# EAGLE design USB_Dongle_Parem (EAGLE 7.2.0)
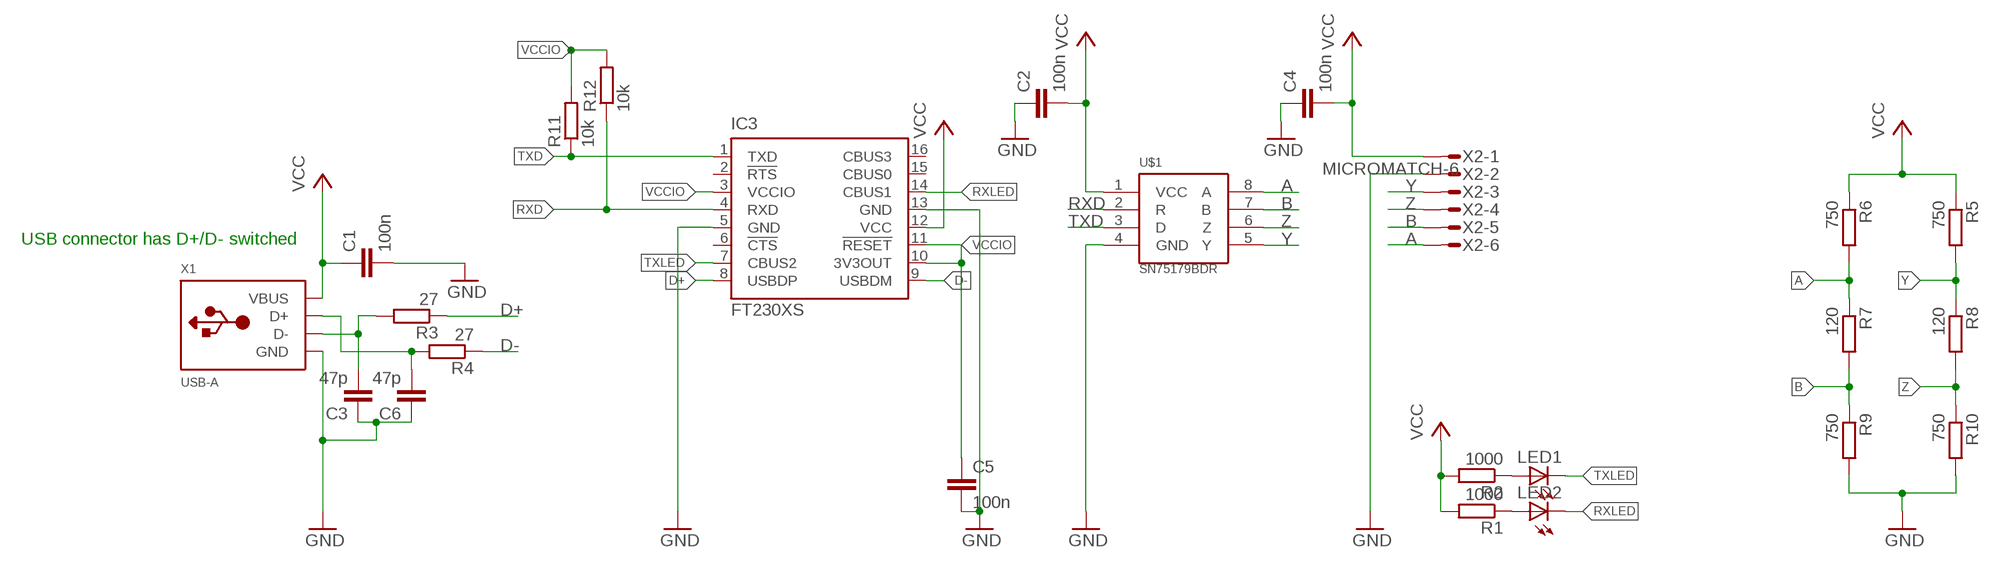
[diagram p0: schematic, sheet 1]

## Parts
C1  100n  CC0603  [C0603]
C2  100n  CC0603  [C0603]
C3  47p  CC0603  [C0603]
C4  100n  CC0603  [C0603]
C5  100n  CC0603  [C0603]
C6  47p  CC0603  [C0603]
IC3  FT230XS  [SSOP16]
LED1  LED_ESML0603  [LED_SML0603]
LED2  LED_ESML0603  [LED_SML0603]
R1  1000  R-EU_R0603  [R0603]
R2  1000  R-EU_R0603  [R0603]
R3  27  R-EU_R0603  [R0603]
R4  27  R-EU_R0603  [R0603]
R5  750  R-EU_R0603  [R0603]
R6  750  R-EU_R0603  [R0603]
R7  120  R-EU_R0603  [R0603]
R8  120  R-EU_R0603  [R0603]
R9  750  R-EU_R0603  [R0603]
R10  750  R-EU_R0603  [R0603]
R11  10k  R-EU_R0603  [R0603]
R12  10k  R-EU_R0603  [R0603]
U$1  SN75179BDR  [SOIC8]
X1  USB-A  [MOLEX_480371000]
X2  MICROMATCH-6  [MICROMATCH-6]

## Nets
A: R6.2 R7.1 U$1.8(A) X2.6
B: R7.2 R9.1 U$1.7(B) X2.5
D+: IC3.8(USBDP) R3.1
D-: IC3.9(USBDM) R4.1
GND: C1.2 C2.1 C3.1 C4.1 C5.2 C6.1 IC3.5(GND) IC3.13(GND) R9.2 R10.2 U$1.4(GND) X1.4(GND) X2.2
N$7: LED2.A R1.1
N$8: LED1.A R2.1
RXD: IC3.4(RXD) R12.1 U$1.2(R)
RXLED: IC3.14(CBUS1) LED2.C
SA: C3.2 R3.2 X1.2(D-)
SAD: C6.2 R4.2 X1.3(D+)
TXD: IC3.1(TXD) R11.1 U$1.3(D)
TXLED: IC3.7(CBUS2) LED1.C
VCC: C1.1 C2.2 C4.2 IC3.12(VCC) R1.2 R2.2 R5.1 R6.1 U$1.1(VCC) X1.1(VBUS) X2.1
VCCIO: C5.1 IC3.3(VCCIO) IC3.10(3V3OUT) IC3.11(!RESET) R11.2 R12.2
Y: R5.2 R8.1 U$1.5(Y) X2.3
Z: R8.2 R10.1 U$1.6(Z) X2.4
Unconnected: IC3.2(!RTS) IC3.6(!CTS) IC3.15(CBUS0) IC3.16(CBUS3)

## Notes on the sheet
- USB connector has D+/D- switched

## Library data of the parts
C1-C6 = eagle-ltspice:C: CAPACITOR, European symbol; SPICEMODEL: NONE; SPICEPREFIX: C
IC3 = ftdichip:FT230X: USB to BASIC UART IC Auto generated by make-symbol-device-package-bsdl.ulp Rev. 43 Source: Data sheet <http://www.ftdichip.com/Support/Documents/DataSheets/ICs/DS_FT230X.pdf>
LED1 LED2 = eagle-ltspice:LED_E: LED Source: http://www.osram.convergy.de Source: www.luxeon.com Source: www.kingbright.com; SPICEMODEL: NONE; SPICEPREFIX: D; SPICETYPE: diode
R1-R12 = resistor:R-EU_: RESISTOR, European symbol
U$1 = SparkFun-DigitalIC:SN75179BDR
X1 = adafruit:USB-A: USB type A 'plug' Used for things that can directly connect to a USB port, say USB key
X2 = con-amp-micromatch:MICROMATCH-6: MicroMaTch 6 7-215464-6 / 0-215464-6 Drawing Number C-215464 DDEController.pdf; MPN: 7-215464-6; OC_FARNELL: 3784630; OC_NEWARK: 19R8125

## Board
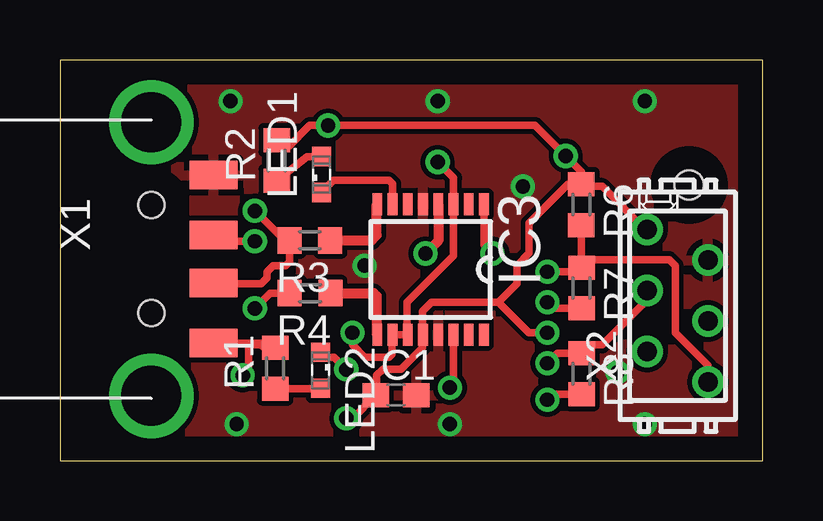
[diagram p1: board, top side]
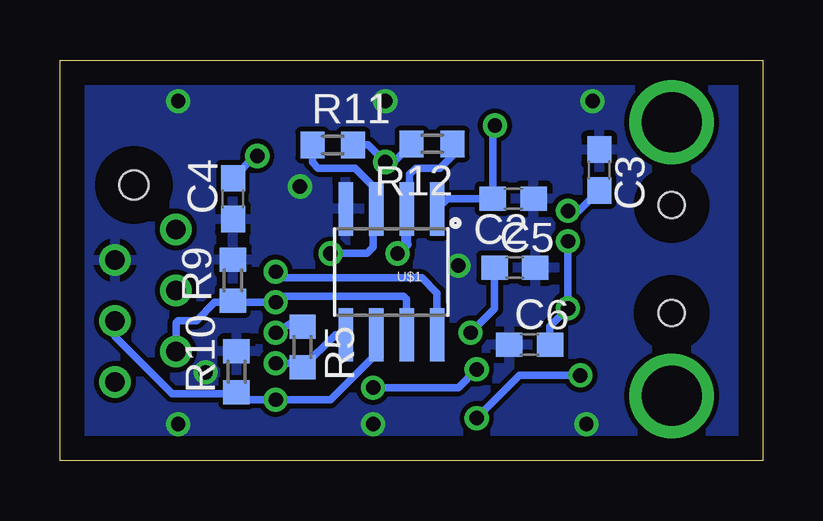
[diagram p2: board, bottom side, seen from below]

Size 29.31 x 16.71 mm. Coordinates in mm from the lower left corner, seen from the top.
Outline: 0,0.01 29.31,0 29.31,16.7 0,16.71 0,0.01
Copper layers (1*16): Top 0.035mm / dielectric 1.5mm / Bottom 0.035mm
Design rules "default": minimum track width 10mil, minimum drill 24mil, track to track 8mil, track to pad 8mil, pad to pad 8mil, via to via 8mil, smd to smd 8mil, copper to edge 40mil, drill to drill 8mil, minimum pad ring 10mil, minimum via ring 8mil, stop-mask expansion 4mil, vias tented up to drill 0mil, thermal gap 10mil
Holes 1.2 mm at 26.23,11.5

### Footprints (pad centres in the part's own frame; a part is rotated, then mirrored left to right if it is on the bottom)
C0603 = smd 1.1 x 1: 1 -0.85,0; 2 0.85,0
SSOP16 = smd 0.914 x 0.406: 1 -2.718,2.223; 2 -2.718,1.587; 3 -2.718,0.953; 4 -2.718,0.318; 5 -2.718,-0.318; 6 -2.718,-0.953; 7 -2.718,-1.587; 8 -2.718,-2.223; 9 2.718,-2.223; 10 2.718,-1.587; 11 2.718,-0.953; 12 2.718,-0.318; 13 2.718,0.318; 14 2.718,0.953; 15 2.718,1.587; 16 2.718,2.223
LED_SML0603 = smd 0.8 x 0.8: A 0.75,0; C -0.75,0
R0603 = smd 1 x 1.1: 1 -0.85,0; 2 0.85,0
SOIC8 = smd 0.61 x 2.21: 1 -1.905,-2.616; 2 -0.635,-2.616; 3 0.635,-2.616; 4 1.905,-2.616; 5 1.905,2.616; 6 0.635,2.616; 7 -0.635,2.616; 8 -1.905,2.616
MOLEX_480371000 = smd 1.2 x 2: 1 3.5,2.6; 2 1,2.6; 3 -1,2.6; 4 -3.5,2.6 | drill 2.5: M1 -5.7,0; M2 5.7,0 | hole 1.1: -2.25,0; 2.25,0
MICROMATCH-6 = drill 0.813: 1 3.175,1.27; 2 1.905,-1.27; 3 0.635,1.27; 4 -0.635,-1.27; 5 -1.905,1.27; 6 -3.175,-1.27

### Placement (x,y rotation side)
C1  14.01,2.74 0 top
C2  10.41,10.93 180 bottom
C3  6.83,12.12 270 bottom
C4  22.1,10.93 90 bottom
C5  10.34,8.05 0 bottom
C6  9.73,4.84 0 bottom
IC3  15.45,7.98 270 top
LED1  10.9,11.93 90 top
LED2  10.87,3.78 270 top
R1  8.98,3.86 90 top
R2  9.04,12.52 90 top
R3  10.42,9.19 180 top
R4  10.43,6.99 180 top
R5  19.2,4.75 270 bottom
R6  21.74,10.68 270 top
R7  21.75,7.21 270 top
R8  21.75,3.64 270 top
R9  22.1,7.53 90 bottom
R10  21.95,3.72 90 bottom
R11  17.93,13.17 0 bottom
R12  13.8,13.21 180 bottom
U$1  15.49,7.88 180 bottom
X1  3.81,8.41 270 top
X2  25.75,6.47 90 top

### Tracks (layer width: path | path; a pad name or v marks a point on that pad's centre or on a via)
A  (via drill 0.6)
  Top 0.305: v20.32,7.88 21.57,7.88 R7.1 | R7.1 R6.2 | X2.6 27.02,3.98 25.65,5.34 25.65,8.14 25.4,8.39 22.08,8.39 R7.1
  Bottom 0.305: v20.32,7.88 20.07,7.63 14.22,7.63 13.59,7 U$1.8
B  (via drill 0.6)
  Top 0.305: R7.2 20.57,6.36 v20.32,6.61
  Bottom 0.305: U$1.7 14.86,6.74 14.99,6.87 20.07,6.87 v20.32,6.61 22.03,6.61 R9.1 22.17,6.61 22.86,6.61 23.62,5.85 24.38,5.85 24.48,5.76 X2.5
D+
  Top 0.406: R3.1 12.99,9.19 13.21,9.41 13.21,10.67 IC3.8
D-
  Top 0.406: R4.1 13.08,6.99 13.21,6.87 13.21,5.29 IC3.9
GND  (via drill 0.6)
  other vias: 19.3,11.44 7.11,15 7.37,1.53 12.7,8.14 16.26,1.53 15.75,15 24.38,15 23.24,3.69 24.38,1.53
  pour Top: 0,18.55 29.97,18.55 29.97,-0.75 0,-0.75
  pour Bottom: 0,18.55 29.72,18.04 29.46,-0.75 0,-0.75
N$7
  Top 0.305: R1.1 10.85,3.01 LED2.A
N$8
  Top 0.305: LED1.A 10.3,12.68 R2.1
RXD  (via drill 0.6)
  Top 0.406: IC3.4 15.77,9.18 v15.24,8.65
  Bottom 0.305: R12.1 12.95,12.72 13.46,12.2 14.48,12.2 14.73,11.95 14.73,10.63 U$1.2
  Bottom 0.406: v15.24,8.65 14.86,9.03 U$1.2
RXLED  (via drill 0.6)
  Top 0.305: IC3.14 16.41,3.21 v16.26,3.06 | v11.94,3.82 11.43,4.33 11.07,4.33 LED2.C
  Bottom 0.305: v16.26,3.06 12.7,3.06 v11.94,3.82
SA  (via drill 0.6)
  Top 0.305: X1.2 6.45,7.38 8.38,7.38 8.64,7.63 8.64,7.88 8.89,8.14 9.4,8.14 9.57,8.31 R3.2 9.36,9.19 v8.13,10.42
  Bottom 0.305: v8.13,10.42 7.68,10.42 C3.2
SAD  (via drill 0.6)
  Top 0.305: R4.2 8.76,6.99 v8.13,6.36 | v8.13,9.15 6.67,9.15 X1.3
  Bottom 0.305: v8.13,9.15 v8.13,6.36 8.88,5.61 C6.2
TXD  (via drill 0.6)
  Top 0.305: IC3.1 17.68,9 v18.03,8.65
  Bottom 0.305: v18.03,8.65 16.51,8.65 16.26,8.9 16.26,10.37 U$1.3 16.26,10.63 16.26,11.44 17.02,12.2 18.54,12.2 18.78,12.44 R11.1
TXLED
  Top 0.305: IC3.7 13.87,11.54 13.72,11.69 11.41,11.69 LED1.C
VCC  (via drill 0.6)
  Top 0.305: R6.1 21.74,12.06 v21.08,12.71 19.81,13.98 v11.18,13.98 10.41,13.98 9.55,13.11 R2.2 | v20.32,5.34 19.56,5.34 18.29,6.61 | 18.29,6.61 15.49,6.61 15.11,6.23 15.11,5.29 | 15.11,5.29 IC3.12 | X1.1 8.78,4.91 R1.2 8.51,4.71 8.38,4.84 7.87,4.84 7.87,3.82 v7.62,3.57 | R6.1 21.17,11.53 19.56,9.92 19.56,8.65 19.05,8.14 19.05,7.38 18.29,6.61 | 15.11,5.29 15.11,4.71 14.22,3.82 13.46,3.82 13.21,3.57 13.21,2.78 C1.1 12.21,1.79 v11.94,1.79 | X2.1 24.41,9.64 22.61,11.44 21.83,11.44 R6.1
  Bottom 0.305: v21.08,12.71 21.17,12.71 C4.2 | R5.1 19.68,5.73 v20.32,5.34 | U$1.1 13.16,10.93 C2.2 11.26,13.89 v11.18,13.98 | v7.62,3.57 10.16,3.57 v11.94,1.79
VCCIO  (via drill 0.6)
  Top 0.305: v12.19,5.34 12.19,4.84 12.7,4.33 13.72,4.33 13.84,4.46 13.84,5.24 IC3.10 IC3.11 14.48,5.29 14.48,6.61 16.41,8.54 IC3.3 16.41,11.8 v15.75,12.46
  Bottom 0.305: C5.1 11.19,6.34 v12.19,5.34 | R12.2 15.4,12.46 v15.75,12.46 16.46,13.17 R11.2
Y  (via drill 0.6)
  Top 0.305: v20.32,4.07 20.73,4.49 R8.1 22.1,4.84 22.61,4.84 24.48,6.71 X2.3
  Bottom 0.305: U$1.5 17.83,5.27 R5.2 19.37,4.07 v20.32,4.07
Z  (via drill 0.6)
  Top 0.305: R8.2 20.56,2.79 v20.32,2.55
  Bottom 0.305: U$1.6 16.13,4.46 18.03,2.55 v20.32,2.55 21.63,2.55 R10.1 22.02,2.8 24.64,2.8 27.02,5.18 X2.4